# Altium schematic sheet RFID_DACS-01.SchDoc: BLOCK DIAGRAM
size A; DrawnBy: AYTAC DILEK
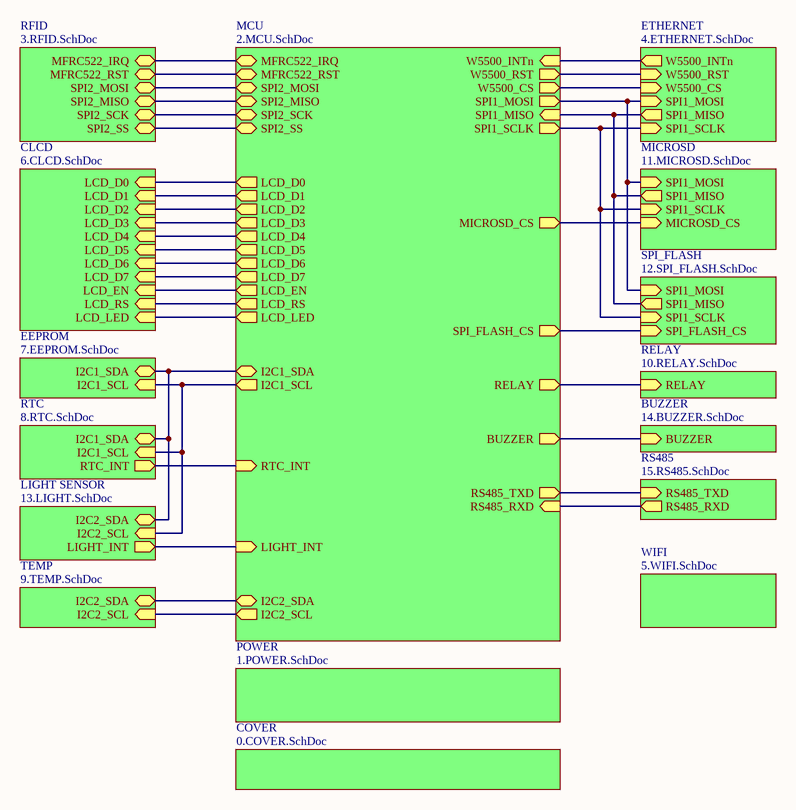
[diagram p0: RFID_DACS-01.SchDoc]

## Sub-sheets
BUZZER = 14.BUZZER.SchDoc: BUZZER (in)
CLCD = 6.CLCD.SchDoc: LCD_D0 (in), LCD_D1 (in), LCD_D2 (in), LCD_D3 (in), LCD_D5 (in), LCD_D4 (in), LCD_D6 (in), LCD_D7 (in), LCD_EN (in), LCD_RS (in), LCD_LED (in)
COVER = 0.COVER.SchDoc: no entries
EEPROM = 7.EEPROM.SchDoc: I2C1_SDA (bidir), I2C1_SCL (in)
ETHERNET = 4.ETHERNET.SchDoc: W5500_INTn (out), W5500_RST (in), W5500_CS (in), SPI1_MOSI (in), SPI1_MISO (out), SPI1_SCLK (in)
LIGHT SENSOR = 13.LIGHT.SchDoc: I2C2_SDA (bidir), I2C2_SCL (in), LIGHT_INT (out)
MCU = 2.MCU.SchDoc: W5500_INTn (in), W5500_RST (out), W5500_CS (out), SPI1_MOSI (out), SPI1_MISO (in), SPI1_SCLK (out), MFRC522_IRQ, MFRC522_RST, SPI2_MOSI, SPI2_MISO, SPI2_SCK, SPI2_SS, MICROSD_CS (out), SPI_FLASH_CS (out), LCD_D1 (out), LCD_D2 (out), LCD_D3 (out), LCD_D4 (out), LCD_D5 (out), LCD_D6 (out), LCD_D0 (out), LCD_D7 (out), LCD_EN (out), LCD_RS (out), LCD_LED (out), I2C1_SDA (bidir), I2C1_SCL (out), RTC_INT (in), I2C2_SDA (bidir), I2C2_SCL (out), RELAY (out), BUZZER (out), RS485_TXD (out), RS485_RXD (in), LIGHT_INT (in)
MICROSD = 11.MICROSD.SchDoc: SPI1_MOSI (in), SPI1_MISO (out), SPI1_SCLK (in), MICROSD_CS (in)
POWER = 1.POWER.SchDoc: no entries
RELAY = 10.RELAY.SchDoc: RELAY (in)
RFID = 3.RFID.SchDoc: MFRC522_IRQ, MFRC522_RST, SPI2_MOSI, SPI2_MISO, SPI2_SCK, SPI2_SS
RS485 = 15.RS485.SchDoc: RS485_TXD (in), RS485_RXD (out)
RTC = 8.RTC.SchDoc: I2C1_SDA (bidir), I2C1_SCL (in), RTC_INT (out)
SPI_FLASH = 12.SPI_FLASH.SchDoc: SPI1_MOSI (in), SPI1_MISO (out), SPI1_SCLK (in), SPI_FLASH_CS (in)
TEMP = 9.TEMP.SchDoc: I2C2_SDA (bidir), I2C2_SCL (in)
WIFI = 5.WIFI.SchDoc: no entries

## Nets
(unnamed): sheet MCU/W5500_INTn, sheet ETHERNET/W5500_INTn
(unnamed): sheet MCU/W5500_RST, sheet ETHERNET/W5500_RST
(unnamed): sheet MCU/W5500_CS, sheet ETHERNET/W5500_CS
(unnamed): sheet MCU/SPI1_MOSI, sheet ETHERNET/SPI1_MOSI, sheet MICROSD/SPI1_MOSI, sheet SPI_FLASH/SPI1_MOSI
(unnamed): sheet MCU/SPI1_MISO, sheet ETHERNET/SPI1_MISO, sheet MICROSD/SPI1_MISO, sheet SPI_FLASH/SPI1_MISO
(unnamed): sheet MCU/SPI1_SCLK, sheet ETHERNET/SPI1_SCLK, sheet MICROSD/SPI1_SCLK, sheet SPI_FLASH/SPI1_SCLK
(unnamed): sheet MCU/MFRC522_IRQ, sheet RFID/MFRC522_IRQ
(unnamed): sheet MCU/MFRC522_RST, sheet RFID/MFRC522_RST
(unnamed): sheet MCU/SPI2_MOSI, sheet RFID/SPI2_MOSI
(unnamed): sheet MCU/SPI2_MISO, sheet RFID/SPI2_MISO
(unnamed): sheet MCU/SPI2_SCK, sheet RFID/SPI2_SCK
(unnamed): sheet MCU/SPI2_SS, sheet RFID/SPI2_SS
(unnamed): sheet MCU/MICROSD_CS, sheet MICROSD/MICROSD_CS
(unnamed): sheet MCU/SPI_FLASH_CS, sheet SPI_FLASH/SPI_FLASH_CS
(unnamed): sheet MCU/LCD_D1, sheet CLCD/LCD_D1
(unnamed): sheet MCU/LCD_D2, sheet CLCD/LCD_D2
(unnamed): sheet MCU/LCD_D3, sheet CLCD/LCD_D3
(unnamed): sheet MCU/LCD_D4, sheet CLCD/LCD_D4
(unnamed): sheet MCU/LCD_D5, sheet CLCD/LCD_D5
(unnamed): sheet MCU/LCD_D6, sheet CLCD/LCD_D6
(unnamed): sheet MCU/LCD_D0, sheet CLCD/LCD_D0
(unnamed): sheet MCU/LCD_D7, sheet CLCD/LCD_D7
(unnamed): sheet MCU/LCD_EN, sheet CLCD/LCD_EN
(unnamed): sheet MCU/LCD_RS, sheet CLCD/LCD_RS
(unnamed): sheet MCU/LCD_LED, sheet CLCD/LCD_LED
(unnamed): sheet MCU/I2C1_SDA, sheet EEPROM/I2C1_SDA, sheet RTC/I2C1_SDA, sheet LIGHT SENSOR/I2C2_SDA
(unnamed): sheet MCU/I2C1_SCL, sheet EEPROM/I2C1_SCL, sheet RTC/I2C1_SCL, sheet LIGHT SENSOR/I2C2_SCL
(unnamed): sheet MCU/RTC_INT, sheet RTC/RTC_INT
(unnamed): sheet MCU/I2C2_SDA, sheet TEMP/I2C2_SDA
(unnamed): sheet MCU/I2C2_SCL, sheet TEMP/I2C2_SCL
(unnamed): sheet MCU/RELAY, sheet RELAY/RELAY
(unnamed): sheet MCU/BUZZER, sheet BUZZER/BUZZER
(unnamed): sheet MCU/RS485_TXD, sheet RS485/RS485_TXD
(unnamed): sheet MCU/RS485_RXD, sheet RS485/RS485_RXD
(unnamed): sheet MCU/LIGHT_INT, sheet LIGHT SENSOR/LIGHT_INT